# Altium schematic sheet Isolated_gate_driver.SchDoc
size A
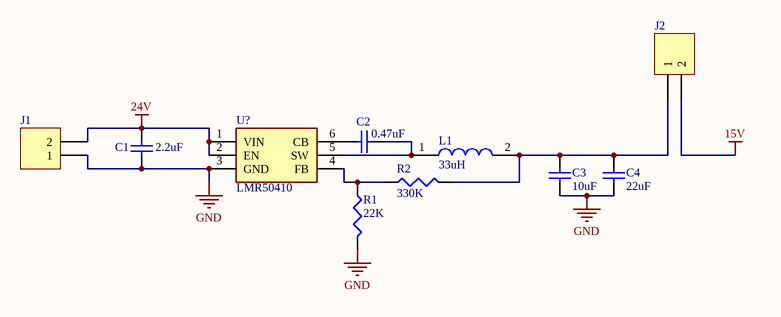
[diagram p0: Isolated_gate_driver.SchDoc]

## Parts
C1  value 2.2uF  [C0805]  (hidden comment: Cap)
C2  value 0.47uF  [C0805]  (hidden comment: Cap)
C3  value 10uF  [C0805]  (hidden comment: Cap)
C4  value 22uF  [C0805]  (hidden comment: Cap)
J1  Header 2  [HDR1X2]  (value not drawn)
J2  Header 2  [HDR1X2]  (value not drawn)
L1  33uH  [PM4340682NLT]
R1  value 22K  [J1-0603]  (hidden comment: Res3)
R2  value 330K  [J1-0603]  (hidden comment: Res3)
U?  LMR50410  [SOT95P280X145-6N]

## Nets
15V: J2.2
24V: C1.1 J1.2 U?.1(VIN) U?.2(EN)
GND: C1.2 C3.2 C4.2 J1.1 R1.2 U?.3(GND)
NetC2_1: C2.1 U?.6(CB)
NetC2_2: C2.2 L1.1 U?.5(SW)
NetC3_1: C3.1 C4.1 J2.1 L1.2 R2.2
NetR1_1: R1.1 R2.1 U?.4(FB)

## Library data of the parts
C1-C4 = Cap: Capacitor; Published: 8-Jun-2000; LatestRevisionDate: 17-Jul-2002; LatestRevisionNote: Re-released for DXP Platform.; PackageReference: RAD-0.3; Publisher: Altium Limited; PackageDescription: Radial Cap, Thru-Hole; 2 Leads; 0.3 in Pin Spacing
J1 J2 = Header 2: Header, 2-Pin; LatestRevisionDate: 17-Jul-2002; LatestRevisionNote: Re-released for DXP Platform.; Publisher: Altium Limited
L1 = PM4340.333NLT: Inductor; Manufacturer_Name: Pulse; Datasheet Link: https://products.pulseelex.com/files/product_files/P767.pdf; Height: 2mm; Manufacturer_Part_Number: PM4340.333NLT; Arrow Part Number: PM4340.333NLT
R1 R2 = Res3: Resistor; Published: 8-Jun-2000; LatestRevisionDate: 29-May-2009; LatestRevisionNote: IPC-7351 Footprint Added.; PackageReference: J1-0603; Publisher: Altium Limited; PackageDescription: Chip Resistor
U? = LMR50410: Integrated Circuit; Manufacturer_Name: Texas Instruments; Datasheet Link: https://www.ti.com/lit/ds/symlink/lmr50410.pdf?ts=1598511476132&ref_url=https%253A%252F%252Fwww.ti.com%252Fproduct%252FLMR50410; Height: 1.45mm; Manufacturer_Part_Number: LMR50410; Arrow Part Number: LMR50410